# EAGLE design Proto_shield_REV3 (EAGLE 7.1.0)
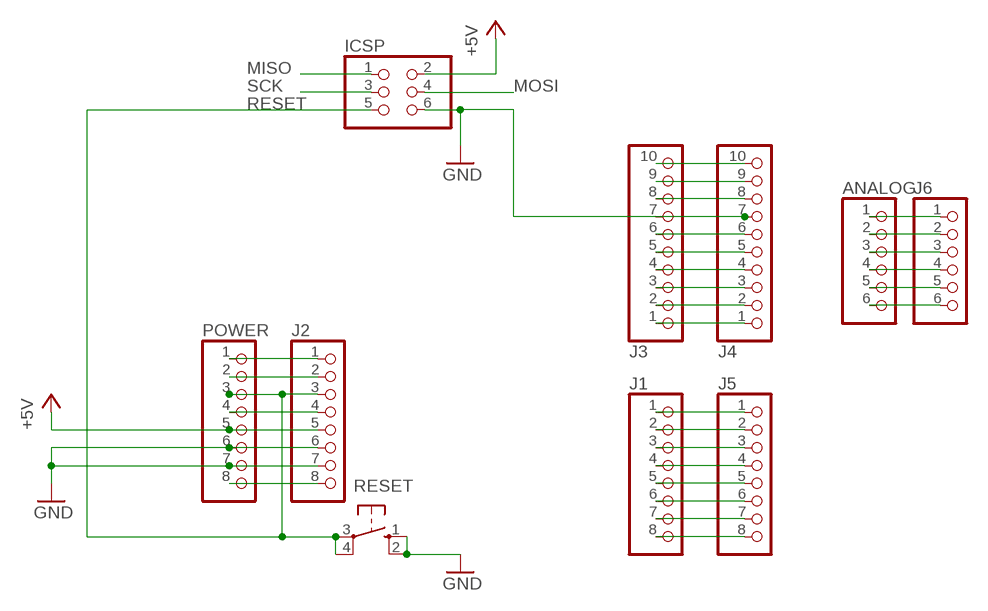
[diagram p0: schematic, sheet 1]

## Parts
ANALOG  PINHD-1X6  [1X06]
ICSP  PINHD-2X3  [2X03]
J1  PINHD-1X8TH  [1X08-TH]
J2  PINHD-1X8TH  [1X08-TH]
J3  PINHD-1X10TH  [1X10-TH]
J4  PINHD-1X10TH  [1X10-TH]
J5  PINHD-1X8TH  [1X08-TH]
J6  PINHD-1X6  [1X06]
POWER  PINHD-1X8TH  [1X08-TH]
RESET  10-XX  [B3F-10XX]

## Nets
+5V: ICSP.2 J2.5 POWER.5
+9V: J2.8 POWER.8
GND: ICSP.6 J2.7 J3.7 J4.7 POWER.7 RESET.1(S) RESET.2(S1)
MISO: ICSP.1
MOSI: ICSP.4
N$1: J3.6 J4.6
N$2: J3.1 J4.1
N$3: J3.4 J4.4
N$4: J3.5 J4.5
N$6: J3.2 J4.2
N$7: J3.3 J4.3
N$8: J1.1 J5.1
N$9: J1.2 J5.2
N$10: J1.3 J5.3
N$11: J1.4 J5.4
N$12: J1.5 J5.5
N$13: J1.6 J5.6
N$14: J1.7 J5.7
N$15: J1.8 J5.8
N$18: ANALOG.1 J6.1
N$19: ANALOG.2 J6.2
N$20: ANALOG.3 J6.3
N$21: ANALOG.4 J6.4
N$22: ANALOG.5 J6.5
N$23: ANALOG.6 J6.6
N$25: J2.6 POWER.6
N$31: J2.2 POWER.2
N$32: J2.1 POWER.1
N$141: J3.9 J4.9
N$142: J3.10 J4.10
N$222: J3.8 J4.8
N$223: J2.4 POWER.4
RESET: ICSP.5 J2.3 POWER.3 RESET.3(P) RESET.4(P1)
SCK: ICSP.3

## Library data of the parts
ANALOG J6 = pinhead:PINHD-1X6: PIN HEADER
ICSP = SmartPrj:PINHD-2X3: PIN HEADER
J1 J2 J5 POWER = SmartPrj:PINHD-1X8: PIN HEADER
J3 J4 = SmartPrj:PINHD-1X10: PIN HEADER
RESET = switch-omron:10-XX: OMRON SWITCH

## Board
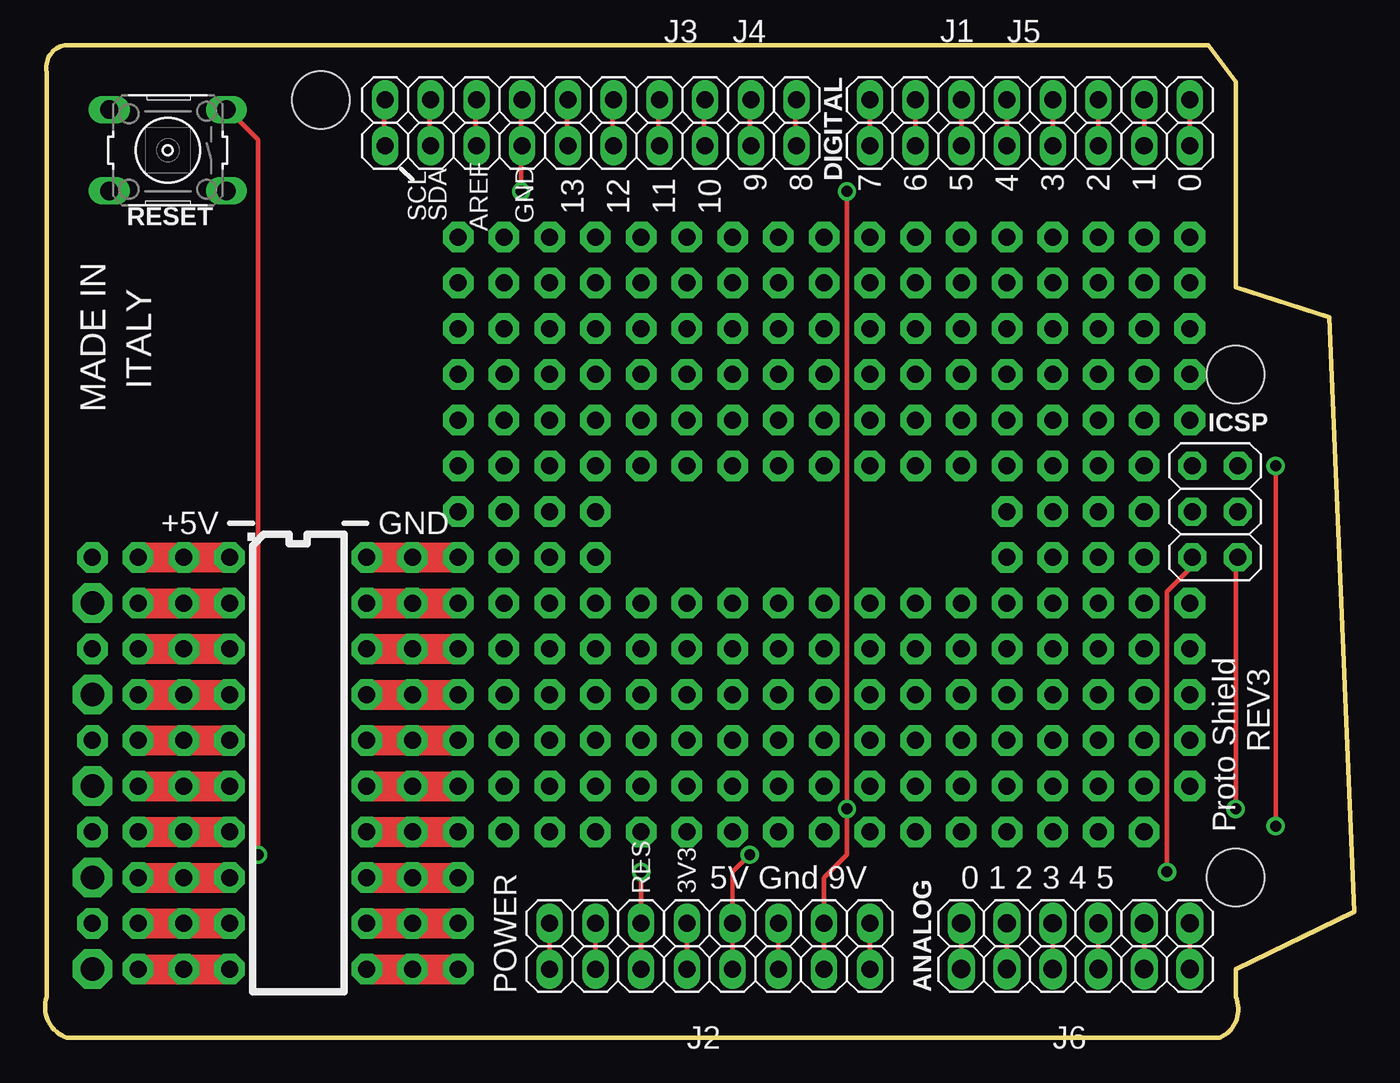
[diagram p1: board, top side]
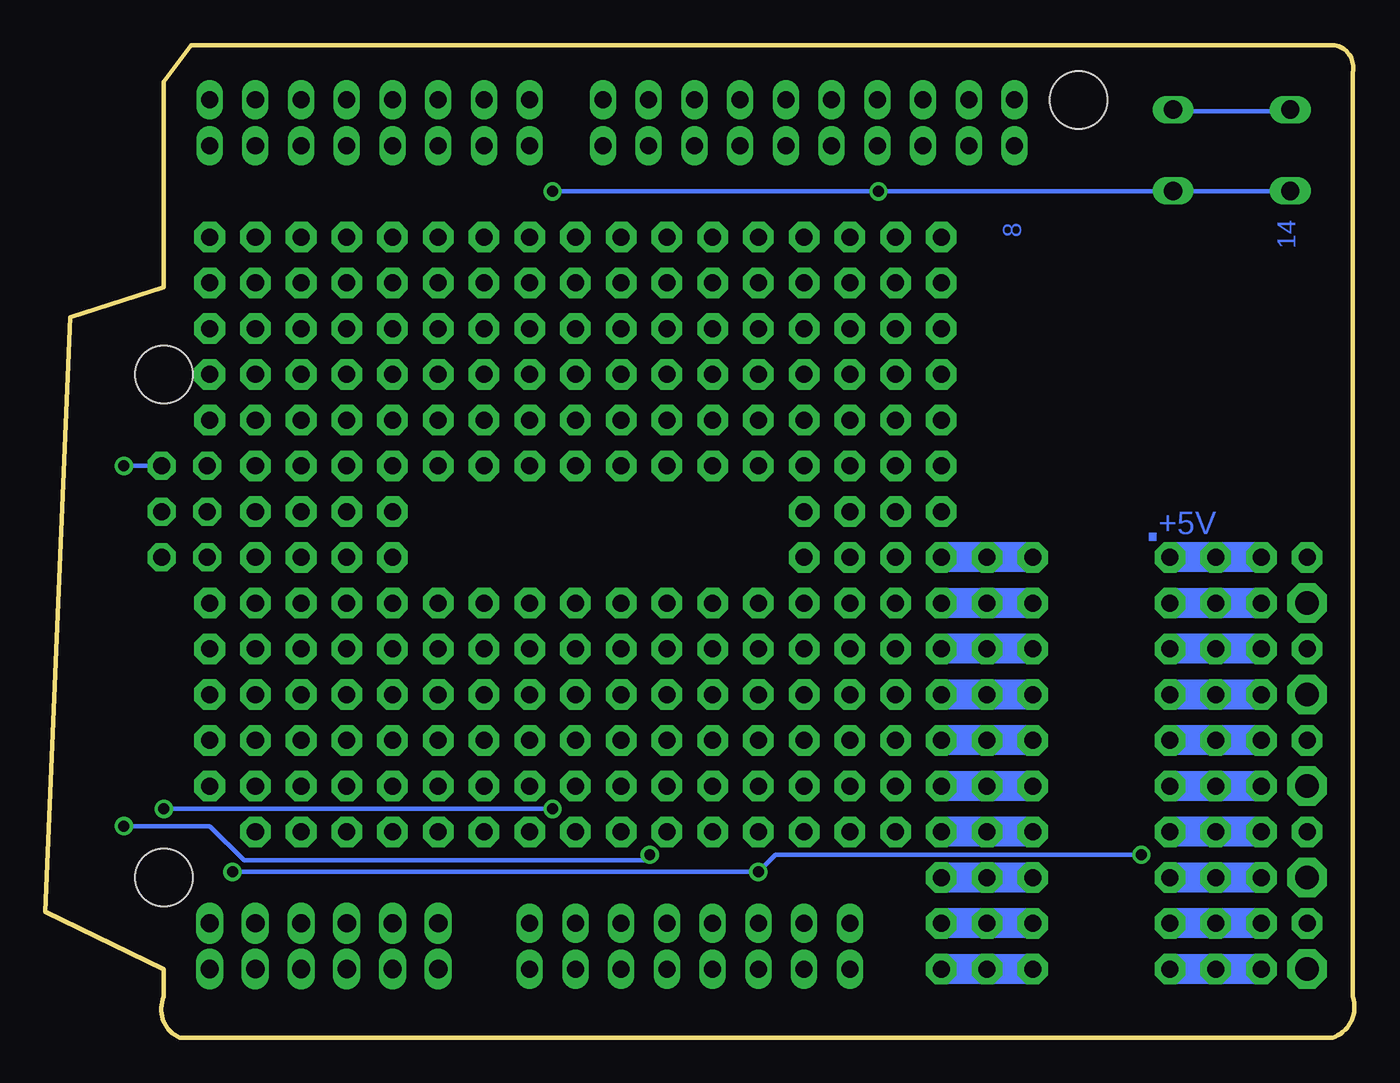
[diagram p2: board, bottom side, seen from below]

Size 72.74 x 55.12 mm. Coordinates in mm from the lower left corner, seen from the top.
Outline: 64.61,55.12 66.13,53.09 66.13,41.66 71.34,40.01 72.74,6.98 66.13,3.81 66.13,2.27 arc-90 65.26,0 1.22,0 arc-90 0.09,2.27 0.09,53.61 arc-90 1.09,55.12 64.61,55.12
Copper layers (1*16): Top 0.035mm / dielectric 1.5mm / Bottom 0.035mm
Design rules "default": minimum track width 10mil, minimum drill 24mil, track to track 8mil, track to pad 8mil, pad to pad 8mil, via to via 8mil, smd to smd 8mil, copper to edge 40mil, drill to drill 8mil, minimum pad ring 10mil, minimum via ring 8mil, stop-mask expansion 2mil, vias tented up to drill 0mil, thermal gap 10mil
Holes 3.2 mm at 15.33,52.07 66.13,8.89 66.13,36.83

### Footprints (pad centres in the part's own frame; a part is rotated, then mirrored left to right if it is on the bottom)
1X06 = drill 1.016 long: 1 -6.35,0; 2 -3.81,0; 3 -1.27,0; 4 1.27,0; 5 3.81,0; 6 6.35,0
2X03 = drill 0.95 pad 1.55 octagon: 1 -2.54,-1.27; 2 -2.54,1.27; 3 0,-1.27; 4 0,1.27; 5 2.54,-1.27; 6 2.54,1.27
1X08-TH = drill 0.95 pad 1.422 long: 1 -8.89,0; 2 -6.35,0; 3 -3.81,0; 4 -1.27,0; 5 1.27,0; 6 3.81,0; 7 6.35,0; 8 8.89,0
1X10-TH = drill 0.95 pad 1.422 long: 1 -11.43,0; 2 -8.89,0; 3 -6.35,0; 4 -3.81,0; 5 -1.27,0; 6 1.27,0; 7 3.81,0; 8 6.35,0; 9 8.89,0; 10 11.43,0
B3F-10XX = drill 1.016 long: 1 -3.251,2.261; 2 3.251,2.261; 3 -3.251,-2.261; 4 3.251,-2.261

### Placement (x,y rotation side)
ANALOG  57.24,3.81 0 top
ICSP  64.99,29.21 270 top
J1  54.7,52.07 180 top
J2  36.92,3.81 0 top
J3  30.32,52.07 180 top
J4  30.32,49.53 180 top
J5  54.7,49.53 180 top
J6  57.24,6.35 0 top
POWER  36.92,6.35 0 top
RESET  6.82,49.28 180 top

### Tracks (layer width: path | path; a pad name or v marks a point on that pad's centre or on a via)
+5V  (via drill 0.61)
  Top 0.254: J2.5 POWER.5 38.19,9.21 v39.14,10.16 | v68.35,11.75 v68.35,31.75
  Bottom 0.254: v68.35,31.75 ICSP.2 | v68.35,11.75 63.59,11.75 61.69,9.84 39.46,9.84 v39.14,10.16
+9V
  Top 0.254: J2.8 POWER.8
GND  (via drill 0.61)
  Top 0.254: 26.44,49.53 26.44,52.07 J3.7 | v26.44,46.99 26.44,49.53 | 26.44,49.53 J4.7 | J2.7 POWER.7 43.27,8.89 44.54,10.16 v44.54,12.7 v44.54,46.99 | v66.13,12.7 66.13,26.67 ICSP.6
  Bottom 0.254: RESET.2 3.58,46.99 9.93,46.99 RESET.1 10.25,46.99 v26.44,46.99 v44.54,46.99 | v44.54,12.7 v66.13,12.7
N$1
  Top 0.254: J3.6 28.98,52.07 28.98,49.53 J4.6
N$2
  Top 0.254: J3.1 41.68,52.07 41.68,49.53 J4.1
N$3
  Top 0.254: J3.4 34.06,52.07 34.06,49.53 J4.4
N$4
  Top 0.254: J3.5 31.52,52.07 31.52,49.53 J4.5
N$6
  Top 0.254: J3.2 39.14,52.07 39.14,49.53 J4.2
N$7
  Top 0.254: J3.3 36.6,52.07 36.6,49.53 J4.3
N$8
  Top 0.254: J5.1 J1.1
N$9
  Top 0.254: J5.2 J1.2
N$10
  Top 0.254: J5.3 J1.3
N$11
  Top 0.254: J5.4 J1.4
N$12
  Top 0.254: J5.5 J1.5
N$13
  Top 0.254: J5.6 J1.6
N$14
  Top 0.254: J5.7 J1.7
N$15
  Top 0.254: J5.8 J1.8
N$16  (via drill 0.95 pad 1.7)
  other vias: 50.89,31.75
N$17  (via drill 0.95 pad 1.7)
  other vias: 53.43,24.13
N$18
  Top 0.254: ANALOG.1 J6.1
N$19
  Top 0.254: ANALOG.2 J6.2
N$20
  Top 0.254: ANALOG.3 J6.3
N$21
  Top 0.254: ANALOG.4 J6.4
N$22
  Top 0.254: ANALOG.5 J6.5
N$23
  Top 0.254: ANALOG.6 J6.6
N$25
  Top 0.254: J2.6 POWER.6
N$26  (via drill 0.95 pad 1.7)
  other vias: 53.43,29.21
N$27  (via drill 0.95 pad 1.7)
  Top 1.676: v17.87,6.35 v22.95,6.35
N$28  (via drill 0.95 pad 1.7)
  other vias: 20.41,6.35
N$29  (via drill 1.3 pad 2.18)
  other vias: 2.63,19.05
N$30  (via drill 0.95 pad 1.7)
  other vias: 2.63,26.67
N$31
  Top 0.254: J2.2 POWER.2
N$32
  Top 0.254: J2.1 POWER.1
N$33  (via drill 0.95 pad 1.7)
  other vias: 7.71,6.35
N$34  (via drill 0.95 pad 1.7)
  Top 1.676: v5.17,6.35 v10.25,6.35
N$35  (via drill 1.3 pad 2.18)
  other vias: 2.63,24.13
N$36  (via drill 0.95 pad 1.7)
  other vias: 20.41,8.89
N$37  (via drill 0.95 pad 1.7)
  Top 1.676: v17.87,8.89 v22.95,8.89
N$38  (via drill 0.95 pad 1.7)
  other vias: 55.97,29.21
N$39  (via drill 0.95 pad 1.7)
  other vias: 58.51,31.75
N$40  (via drill 0.95 pad 1.7)
  other vias: 2.63,6.35
N$41  (via drill 0.95 pad 1.7)
  Top 1.676: v5.17,8.89 v10.25,8.89
N$42  (via drill 0.95 pad 1.7)
  other vias: 7.71,8.89
N$43  (via drill 0.95 pad 1.7)
  other vias: 58.51,29.21
N$44  (via drill 1.3 pad 2.18)
  other vias: 2.63,8.89
N$45  (via drill 0.95 pad 1.7)
  other vias: 45.81,11.43
N$46  (via drill 0.95 pad 1.7)
  other vias: 28.03,11.43
N$47  (via drill 0.95 pad 1.7)
  other vias: 25.49,11.43
N$48  (via drill 0.95 pad 1.7)
  Top 1.676: v17.87,11.43 v22.95,11.43
N$49  (via drill 0.95 pad 1.7)
  other vias: 20.41,11.43
N$50  (via drill 0.95 pad 1.7)
  other vias: 55.97,26.67
N$51  (via drill 0.95 pad 1.7)
  other vias: 58.51,26.67
N$52  (via drill 0.95 pad 1.7)
  other vias: 55.97,24.13
N$53  (via drill 0.95 pad 1.7)
  other vias: 53.43,26.67
N$54  (via drill 0.95 pad 1.7)
  other vias: 7.71,11.43
N$55  (via drill 0.95 pad 1.7)
  Top 1.676: v5.17,11.43 v10.25,11.43
N$56  (via drill 0.95 pad 1.7)
  other vias: 2.63,11.43
N$57  (via drill 0.95 pad 1.7)
  other vias: 53.43,13.97
N$58  (via drill 0.95 pad 1.7)
  other vias: 28.03,13.97
N$59  (via drill 0.95 pad 1.7)
  other vias: 25.49,13.97
N$60
  Bottom 1.676: 17.87,6.35 22.95,6.35
N$61  (via drill 0.95 pad 1.7)
  other vias: 20.41,13.97
N$62  (via drill 0.95 pad 1.7)
  Top 1.676: v17.87,13.97 v22.95,13.97
N$63  (via drill 0.95 pad 1.7)
  other vias: 22.95,29.21
N$64  (via drill 0.95 pad 1.7)
  other vias: 22.95,31.75
N$65  (via drill 0.95 pad 1.7)
  Top 1.676: v5.17,13.97 v10.25,13.97
N$66  (via drill 0.95 pad 1.7)
  other vias: 7.71,13.97
N$67  (via drill 0.95 pad 1.7)
  Top 1.676: v5.17,24.13 v10.25,24.13
N$68  (via drill 1.3 pad 2.18)
  other vias: 2.63,13.97
N$69  (via drill 0.95 pad 1.7)
  other vias: 43.27,16.51
N$70  (via drill 0.95 pad 1.7)
  other vias: 28.03,16.51
N$71  (via drill 0.95 pad 1.7)
  other vias: 25.49,16.51
N$72  (via drill 0.95 pad 1.7)
  Top 1.676: v17.87,16.51 v22.95,16.51
N$73  (via drill 0.95 pad 1.7)
  other vias: 20.41,16.51
N$74  (via drill 0.95 pad 1.7)
  other vias: 7.71,24.13
N$75  (via drill 0.95 pad 1.7)
  other vias: 7.71,21.59
N$76  (via drill 0.95 pad 1.7)
  Top 1.676: v22.95,24.13 v20.41,24.13 v17.87,24.13
N$77  (via drill 0.95 pad 1.7)
  Top 1.676: v22.95,21.59 v20.41,21.59 v17.87,21.59
N$78  (via drill 0.95 pad 1.7)
  other vias: 7.71,16.51
N$79  (via drill 0.95 pad 1.7)
  Top 1.676: v5.17,16.51 v10.25,16.51
N$80  (via drill 0.95 pad 1.7)
  other vias: 2.63,16.51
N$81  (via drill 0.95 pad 1.7)
  other vias: 58.51,19.05
N$82  (via drill 0.95 pad 1.7)
  other vias: 28.03,19.05
N$83  (via drill 0.95 pad 1.7)
  other vias: 25.49,19.05
N$84  (via drill 0.95 pad 1.7)
  Top 1.676: v5.17,19.05 v10.25,19.05
N$85  (via drill 0.95 pad 1.7)
  other vias: 20.41,19.05
N$86  (via drill 0.95 pad 1.7)
  Top 1.676: v17.87,19.05 v22.95,19.05
N$87  (via drill 0.95 pad 1.7)
  Top 1.676: v5.17,21.59 v10.25,21.59
N$88  (via drill 0.95 pad 1.7)
  other vias: 22.95,34.29
N$89  (via drill 0.95 pad 1.7)
  other vias: 22.95,36.83
N$90  (via drill 0.95 pad 1.7)
  other vias: 7.71,19.05
N$91  (via drill 0.95 pad 1.7)
  other vias: 22.95,39.37
N$92  (via drill 0.95 pad 1.7)
  other vias: 2.63,21.59
N$93  (via drill 0.95 pad 1.7)
  other vias: 61.05,21.59
N$94  (via drill 0.95 pad 1.7)
  other vias: 28.03,21.59
N$95  (via drill 0.95 pad 1.7)
  other vias: 25.49,21.59
N$96  (via drill 0.95 pad 1.7)
  other vias: 22.95,41.91
N$105  (via drill 0.95 pad 1.7)
  other vias: 63.59,24.13
N$106  (via drill 0.95 pad 1.7)
  other vias: 28.03,24.13
N$107  (via drill 0.95 pad 1.7)
  other vias: 25.49,24.13
N$108  (via drill 0.95 pad 1.7)
  other vias: 22.95,44.45
N$114
  Bottom 1.676: 5.17,26.67 10.25,26.67
N$115
  Bottom 1.676: 17.87,26.67 22.95,26.67
N$116
  Bottom 1.676: 17.87,24.13 22.95,24.13
N$117  (via drill 0.95 pad 1.7)
  other vias: 61.05,26.67
N$118  (via drill 0.95 pad 1.7)
  Top 1.676: v22.95,26.67 v20.41,26.67 v17.87,26.67
N$119  (via drill 0.95 pad 1.7)
  other vias: 28.03,26.67
N$120  (via drill 0.95 pad 1.7)
  other vias: 25.49,26.67
N$121
  Bottom 1.676: 17.87,21.59 22.95,21.59
N$122
  Bottom 1.676: 17.87,19.05 22.95,19.05
N$123  (via drill 0.95 pad 1.7)
  other vias: 25.49,44.45
N$124
  Bottom 1.676: 17.87,16.51 22.95,16.51
N$125
  Bottom 1.676: 17.87,13.97 22.95,13.97
N$126
  Bottom 1.676: 17.87,11.43 22.95,11.43
N$127
  Bottom 1.676: 5.17,6.35 10.25,6.35
N$128
  Bottom 1.676: 5.17,11.43 10.25,11.43
N$129
  Bottom 1.676: 5.17,13.97 10.25,13.97
N$130
  Bottom 1.676: 5.17,16.51 10.25,16.51
N$131  (via drill 0.95 pad 1.7)
  other vias: 28.03,29.21
N$132  (via drill 0.95 pad 1.7)
  other vias: 25.49,29.21
N$133
  Bottom 1.676: 5.17,19.05 10.25,19.05
N$134
  Bottom 1.676: 5.17,21.59 10.25,21.59
N$135  (via drill 0.95 pad 1.7)
  other vias: 25.49,31.75
N$136
  Bottom 1.676: 5.17,24.13 10.25,24.13
N$137
  Bottom 1.676: 5.17,8.89 10.25,8.89
N$138
  Bottom 1.676: 5.17,3.81 10.25,3.81
N$139
  Bottom 1.676: 17.87,8.89 22.95,8.89
N$140
  Bottom 1.676: 17.87,3.81 22.95,3.81
N$141
  Top 0.254: J3.9 21.36,52.07 21.36,49.53 J4.9
N$142
  Top 0.254: J3.10 18.82,52.07 18.82,49.53 J4.10
N$143  (via drill 0.95 pad 1.7)
  other vias: 28.03,31.75
N$153  (via drill 0.95 pad 1.7)
  other vias: 55.97,34.29
N$155  (via drill 0.95 pad 1.7)
  other vias: 28.03,34.29
N$156  (via drill 0.95 pad 1.7)
  other vias: 25.49,34.29
N$165  (via drill 0.95 pad 1.7)
  other vias: 50.89,36.83
N$167  (via drill 0.95 pad 1.7)
  other vias: 28.03,36.83
N$168  (via drill 0.95 pad 1.7)
  other vias: 25.49,36.83
N$177  (via drill 0.95 pad 1.7)
  other vias: 43.27,39.37
N$178  (via drill 0.95 pad 1.7)
  Top 1.676: v5.17,26.67 v10.25,26.67
N$179  (via drill 0.95 pad 1.7)
  other vias: 28.03,39.37
N$180  (via drill 0.95 pad 1.7)
  other vias: 25.49,39.37
N$189  (via drill 0.95 pad 1.7)
  other vias: 63.59,41.91
N$190  (via drill 0.95 pad 1.7)
  other vias: 7.71,26.67
N$191  (via drill 0.95 pad 1.7)
  other vias: 28.03,41.91
N$192  (via drill 0.95 pad 1.7)
  other vias: 25.49,41.91
N$201  (via drill 0.95 pad 1.7)
  other vias: 38.19,44.45
N$203  (via drill 0.95 pad 1.7)
  other vias: 28.03,44.45
N$222
  Top 0.254: J3.8 23.9,52.07 23.9,49.53 J4.8
N$223
  Top 0.254: J2.4 POWER.4
N$227  (via drill 0.95 pad 1.7)
  other vias: 30.57,39.37
N$228  (via drill 0.95 pad 1.7)
  other vias: 33.11,39.37
N$229  (via drill 0.95 pad 1.7)
  other vias: 30.57,36.83
N$230  (via drill 0.95 pad 1.7)
  other vias: 33.11,36.83
N$231  (via drill 0.95 pad 1.7)
  other vias: 30.57,34.29
N$232  (via drill 0.95 pad 1.7)
  other vias: 33.11,34.29
N$233  (via drill 0.95 pad 1.7)
  other vias: 35.65,36.83
N$234  (via drill 0.95 pad 1.7)
  other vias: 35.65,34.29
N$235  (via drill 0.95 pad 1.7)
  other vias: 33.11,31.75
N$236  (via drill 0.95 pad 1.7)
  other vias: 35.65,31.75
N$237  (via drill 0.95 pad 1.7)
  other vias: 38.19,34.29
N$238  (via drill 0.95 pad 1.7)
  other vias: 38.19,36.83
N$239  (via drill 0.95 pad 1.7)
  other vias: 38.19,31.75
N$240  (via drill 0.95 pad 1.7)
  other vias: 40.73,34.29
N$241  (via drill 0.95 pad 1.7)
  other vias: 40.73,36.83
N$242  (via drill 0.95 pad 1.7)
  other vias: 38.19,39.37
N$243  (via drill 0.95 pad 1.7)
  other vias: 35.65,39.37
N$245  (via drill 0.95 pad 1.7)
  other vias: 33.11,41.91
N$246  (via drill 0.95 pad 1.7)
  other vias: 35.65,41.91
N$247  (via drill 0.95 pad 1.7)
  other vias: 30.57,41.91
N$248  (via drill 0.95 pad 1.7)
  other vias: 30.57,44.45
N$249  (via drill 0.95 pad 1.7)
  other vias: 33.11,44.45
N$251  (via drill 0.95 pad 1.7)
  other vias: 30.57,31.75
N$252  (via drill 0.95 pad 1.7)
  other vias: 30.57,29.21
N$259  (via drill 0.95 pad 1.7)
  other vias: 33.11,24.13
N$261  (via drill 0.95 pad 1.7)
  other vias: 35.65,24.13
N$262  (via drill 0.95 pad 1.7)
  other vias: 38.19,24.13
N$263  (via drill 0.95 pad 1.7)
  other vias: 40.73,24.13
N$267  (via drill 0.95 pad 1.7)
  other vias: 43.27,31.75
N$268  (via drill 0.95 pad 1.7)
  other vias: 40.73,31.75
N$269  (via drill 0.95 pad 1.7)
  other vias: 45.81,31.75
N$271  (via drill 0.95 pad 1.7)
  other vias: 30.57,26.67
N$272  (via drill 0.95 pad 1.7)
  other vias: 30.57,24.13
N$273  (via drill 0.95 pad 1.7)
  other vias: 30.57,21.59
N$274  (via drill 0.95 pad 1.7)
  other vias: 33.11,16.51
N$275  (via drill 0.95 pad 1.7)
  other vias: 33.11,19.05
N$276  (via drill 0.95 pad 1.7)
  other vias: 38.19,19.05
N$277  (via drill 0.95 pad 1.7)
  other vias: 35.65,19.05
N$278  (via drill 0.95 pad 1.7)
  other vias: 35.65,16.51
N$279  (via drill 0.95 pad 1.7)
  other vias: 30.57,16.51
N$280  (via drill 0.95 pad 1.7)
  other vias: 30.57,19.05
N$281  (via drill 0.95 pad 1.7)
  other vias: 38.19,21.59
N$282  (via drill 0.95 pad 1.7)
  other vias: 40.73,21.59
N$283  (via drill 0.95 pad 1.7)
  other vias: 38.19,16.51
N$284  (via drill 0.95 pad 1.7)
  other vias: 30.57,13.97
N$285  (via drill 0.95 pad 1.7)
  other vias: 33.11,13.97
N$286  (via drill 0.95 pad 1.7)
  other vias: 30.57,11.43
N$289  (via drill 0.95 pad 1.7)
  other vias: 33.11,11.43
N$290  (via drill 0.95 pad 1.7)
  other vias: 35.65,11.43
N$291  (via drill 0.95 pad 1.7)
  other vias: 35.65,13.97
N$292  (via drill 0.95 pad 1.7)
  other vias: 38.19,13.97
N$293  (via drill 0.95 pad 1.7)
  other vias: 40.73,19.05
N$294  (via drill 0.95 pad 1.7)
  other vias: 43.27,19.05
N$295  (via drill 0.95 pad 1.7)
  other vias: 43.27,21.59
N$296  (via drill 0.95 pad 1.7)
  other vias: 45.81,21.59
N$297  (via drill 0.95 pad 1.7)
  other vias: 45.81,24.13
N$298  (via drill 0.95 pad 1.7)
  other vias: 43.27,24.13
N$299  (via drill 0.95 pad 1.7)
  other vias: 48.35,24.13
N$304  (via drill 0.95 pad 1.7)
  other vias: 53.43,31.75
N$305  (via drill 0.95 pad 1.7)
  other vias: 48.35,31.75
N$307  (via drill 0.95 pad 1.7)
  other vias: 45.81,34.29
N$309  (via drill 0.95 pad 1.7)
  other vias: 50.89,34.29
N$310  (via drill 0.95 pad 1.7)
  other vias: 48.35,34.29
N$311  (via drill 0.95 pad 1.7)
  other vias: 43.27,34.29
N$312  (via drill 0.95 pad 1.7)
  other vias: 43.27,36.83
N$313  (via drill 0.95 pad 1.7)
  other vias: 45.81,36.83
N$314  (via drill 0.95 pad 1.7)
  other vias: 33.11,21.59
N$315  (via drill 0.95 pad 1.7)
  other vias: 35.65,21.59
N$316  (via drill 0.95 pad 1.7)
  other vias: 45.81,19.05
N$317  (via drill 0.95 pad 1.7)
  other vias: 48.35,21.59
N$318  (via drill 0.95 pad 1.7)
  other vias: 50.89,21.59
N$319  (via drill 0.95 pad 1.7)
  other vias: 50.89,24.13
N$320  (via drill 0.95 pad 1.7)
  other vias: 55.97,21.59
N$321  (via drill 0.95 pad 1.7)
  other vias: 63.59,21.59
N$322  (via drill 0.95 pad 1.7)
  other vias: 63.59,19.05
N$323  (via drill 0.95 pad 1.7)
  other vias: 61.05,19.05
N$324  (via drill 0.95 pad 1.7)
  other vias: 63.59,16.51
N$325  (via drill 0.95 pad 1.7)
  other vias: 63.59,13.97
N$326  (via drill 0.95 pad 1.7)
  other vias: 61.05,13.97
N$327  (via drill 0.95 pad 1.7)
  other vias: 58.51,13.97
N$329  (via drill 1.3 pad 2.18)
  other vias: 2.63,3.81
N$331  (via drill 0.95 pad 1.7)
  other vias: 7.71,3.81
N$332  (via drill 0.95 pad 1.7)
  Top 1.676: v5.17,3.81 v10.25,3.81
N$335  (via drill 0.95 pad 1.7)
  Top 1.676: v17.87,3.81 v22.95,3.81
N$336  (via drill 0.95 pad 1.7)
  other vias: 20.41,3.81
N$353  (via drill 0.95 pad 1.7)
  other vias: 61.05,11.43
N$354  (via drill 0.95 pad 1.7)
  other vias: 58.51,11.43
N$355  (via drill 0.95 pad 1.7)
  other vias: 55.97,11.43
N$356  (via drill 0.95 pad 1.7)
  other vias: 53.43,11.43
N$357  (via drill 0.95 pad 1.7)
  other vias: 50.89,11.43
N$358  (via drill 0.95 pad 1.7)
  other vias: 48.35,11.43
N$359  (via drill 0.95 pad 1.7)
  other vias: 40.73,11.43
N$360  (via drill 0.95 pad 1.7)
  other vias: 38.19,11.43
N$361  (via drill 0.95 pad 1.7)
  other vias: 43.27,11.43
N$362  (via drill 0.95 pad 1.7)
  other vias: 43.27,13.97
N$363  (via drill 0.95 pad 1.7)
  other vias: 40.73,13.97
N$364  (via drill 0.95 pad 1.7)
  other vias: 45.81,13.97
N$365  (via drill 0.95 pad 1.7)
  other vias: 48.35,13.97
N$366  (via drill 0.95 pad 1.7)
  other vias: 55.97,13.97
N$367  (via drill 0.95 pad 1.7)
  other vias: 50.89,13.97
N$368  (via drill 0.95 pad 1.7)
  other vias: 61.05,16.51
N$369  (via drill 0.95 pad 1.7)
  other vias: 58.51,16.51
N$370  (via drill 0.95 pad 1.7)
  other vias: 55.97,16.51
N$371  (via drill 0.95 pad 1.7)
  other vias: 53.43,16.51
N$372  (via drill 0.95 pad 1.7)
  other vias: 50.89,16.51
N$373  (via drill 0.95 pad 1.7)
  other vias: 48.35,16.51
N$374  (via drill 0.95 pad 1.7)
  other vias: 45.81,16.51
N$375  (via drill 0.95 pad 1.7)
  other vias: 40.73,16.51
N$376  (via drill 0.95 pad 1.7)
  other vias: 48.35,19.05
N$377  (via drill 0.95 pad 1.7)
  other vias: 50.89,19.05
N$378  (via drill 0.95 pad 1.7)
  other vias: 53.43,19.05
N$379  (via drill 0.95 pad 1.7)
  other vias: 55.97,19.05
N$380  (via drill 0.95 pad 1.7)
  other vias: 58.51,21.59
N$381  (via drill 0.95 pad 1.7)
  other vias: 53.43,21.59
N$383  (via drill 0.95 pad 1.7)
  other vias: 58.51,24.13
N$385  (via drill 0.95 pad 1.7)
  other vias: 61.05,24.13
N$393  (via drill 0.95 pad 1.7)
  other vias: 61.05,29.21
N$395  (via drill 0.95 pad 1.7)
  other vias: 55.97,31.75
N$396  (via drill 0.95 pad 1.7)
  other vias: 61.05,31.75
N$397  (via drill 0.95 pad 1.7)
  other vias: 63.59,34.29
N$398  (via drill 0.95 pad 1.7)
  other vias: 61.05,34.29
N$399  (via drill 0.95 pad 1.7)
  other vias: 58.51,34.29
N$400  (via drill 0.95 pad 1.7)
  other vias: 53.43,34.29
N$401  (via drill 0.95 pad 1.7)
  other vias: 63.59,36.83
N$402  (via drill 0.95 pad 1.7)
  other vias: 58.51,36.83
N$403  (via drill 0.95 pad 1.7)
  other vias: 61.05,36.83
N$404  (via drill 0.95 pad 1.7)
  other vias: 63.59,39.37
N$405  (via drill 0.95 pad 1.7)
  other vias: 61.05,39.37
N$406  (via drill 0.95 pad 1.7)
  other vias: 58.51,39.37
N$407  (via drill 0.95 pad 1.7)
  other vias: 55.97,39.37
N$408  (via drill 0.95 pad 1.7)
  other vias: 55.97,36.83
N$409  (via drill 0.95 pad 1.7)
  other vias: 53.43,39.37
N$410  (via drill 0.95 pad 1.7)
  other vias: 53.43,36.83
N$411  (via drill 0.95 pad 1.7)
  other vias: 48.35,36.83
N$412  (via drill 0.95 pad 1.7)
  other vias: 50.89,39.37
N$413  (via drill 0.95 pad 1.7)
  other vias: 48.35,39.37
N$414  (via drill 0.95 pad 1.7)
  other vias: 45.81,39.37
N$415  (via drill 0.95 pad 1.7)
  other vias: 40.73,39.37
N$416  (via drill 0.95 pad 1.7)
  other vias: 38.19,41.91
N$417  (via drill 0.95 pad 1.7)
  other vias: 43.27,41.91
N$418  (via drill 0.95 pad 1.7)
  other vias: 40.73,41.91
N$419  (via drill 0.95 pad 1.7)
  other vias: 45.81,41.91
N$420  (via drill 0.95 pad 1.7)
  other vias: 48.35,41.91
N$421  (via drill 0.95 pad 1.7)
  other vias: 50.89,41.91
N$422  (via drill 0.95 pad 1.7)
  other vias: 53.43,41.91
N$423  (via drill 0.95 pad 1.7)
  other vias: 55.97,41.91
N$424  (via drill 0.95 pad 1.7)
  other vias: 58.51,41.91
N$425  (via drill 0.95 pad 1.7)
  other vias: 61.05,41.91
N$426  (via drill 0.95 pad 1.7)
  other vias: 63.59,44.45
N$427  (via drill 0.95 pad 1.7)
  other vias: 61.05,44.45
N$428  (via drill 0.95 pad 1.7)
  other vias: 58.51,44.45
N$429  (via drill 0.95 pad 1.7)
  other vias: 55.97,44.45
N$430  (via drill 0.95 pad 1.7)
  other vias: 50.89,44.45
N$431  (via drill 0.95 pad 1.7)
  other vias: 53.43,44.45
N$432  (via drill 0.95 pad 1.7)
  other vias: 48.35,44.45
N$433  (via drill 0.95 pad 1.7)
  other vias: 45.81,44.45
N$434  (via drill 0.95 pad 1.7)
  other vias: 43.27,44.45
N$435  (via drill 0.95 pad 1.7)
  other vias: 40.73,44.45
N$436  (via drill 0.95 pad 1.7)
  other vias: 35.65,44.45
RESET  (via drill 0.61)
  Top 0.254: J2.3 POWER.3 v33.11,9.21 | v62.32,9.21 62.32,24.77 63.59,26.04 63.59,26.67 ICSP.5 | v11.84,10.16 11.84,49.85 10.25,51.44 RESET.3
  Bottom 0.254: RESET.3 9.93,51.44 3.58,51.44 RESET.4 | v62.32,9.21 v33.11,9.21 32.16,10.16 v11.84,10.16

### Text on the board
Bottom: 14 | 8 | +5V | .
tPlace: 9 | 8 | 7 | 6 | 5 | 4 | 3 | 2 | 1 | 0 | 13 | 12 | 11 | 10 | +5V | GND | . | REV3 | Proto Shield
tNames: DIGITAL | AREF | SCL | SDA | GND | ITALY | MADE IN | RES | 3V3 | 5V Gnd 9V | 0 1 2 3 4 5
bStop: DIGITAL | SDA | AREF | SCL | GND | 13 | 12 | 11 | 9 | 8 | 7 | 6 | 5 | 4 | 3 | 2 | 1 | 0 | 10 | 1 | 2 | 3 | 4 | . | 5 | 6 | IOREF | RST | 3.3V | 5V | GND | GND | VIN | ANALOG | 0 | 1 | 2 | 3 | 4 | 5
Reference: USB | ETH